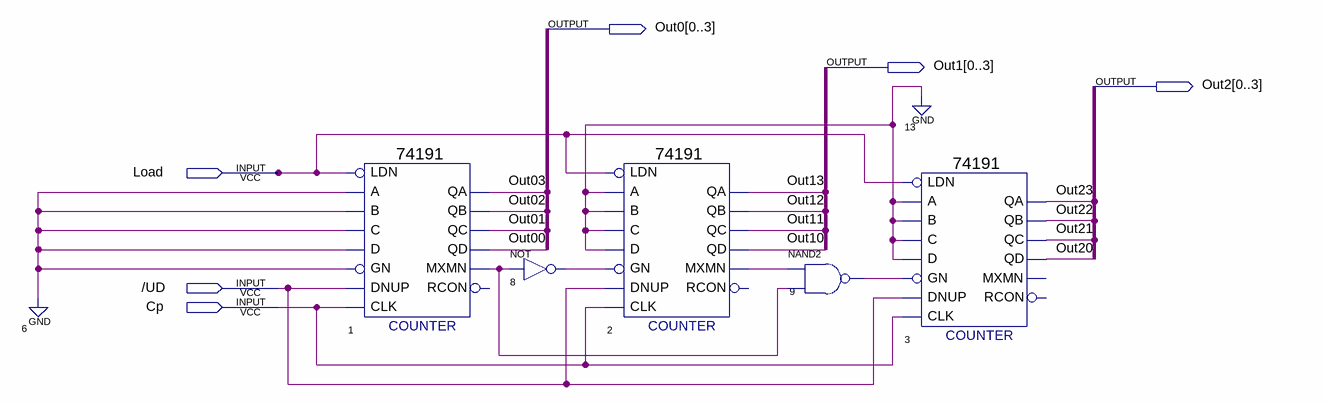
[diagram p0: schematic sheet]
// Quartus schematic fig12-62.bdf as structural Verilog: 5 symbols, 6 pins
module \fig12-62  (
  input  Load,
  input  \/UD ,
  input  Cp,
  output [0:3] Out0,
  output [0:3] Out1,
  output [0:3] Out2
);

  wire n1_mxmn, n2_mxmn, n8_out, n9_out;

  \74191  u_1 (
    .LDN(Load), .D(1'b0), .C(1'b0), .B(1'b0), .A(1'b0), .CLK(Cp), .DNUP(\/UD ), .GN(1'b0), .QA(Out0[3]),
    .QB(Out0[2]), .QC(Out0[1]), .QD(Out0[0]), .MXMN(n1_mxmn));  // open: RCON
  not u_8 (n8_out, n1_mxmn);
  \74191  u_2 (
    .LDN(Load), .D(1'b0), .C(1'b0), .B(1'b0), .A(1'b0), .CLK(Cp), .DNUP(\/UD ), .GN(n8_out), .QA(Out1[3]),
    .QB(Out1[2]), .QC(Out1[1]), .QD(Out1[0]), .MXMN(n2_mxmn));  // open: RCON
  nand u_9 (n9_out, n2_mxmn, n1_mxmn);
  \74191  u_3 (
    .LDN(Load), .D(1'b0), .C(1'b0), .B(1'b0), .A(1'b0), .CLK(Cp), .DNUP(\/UD ), .GN(n9_out), .QA(Out2[3]),
    .QB(Out2[2]), .QC(Out2[1]), .QD(Out2[0]));  // open: MXMN, RCON
endmodule
